# Altium schematic sheet gyro.SchDoc: Fault-Tolerant Quadcopter
size A; DrawnBy: Vaughn Kottler; Engineer: Vaughn Kottler; Revision: A
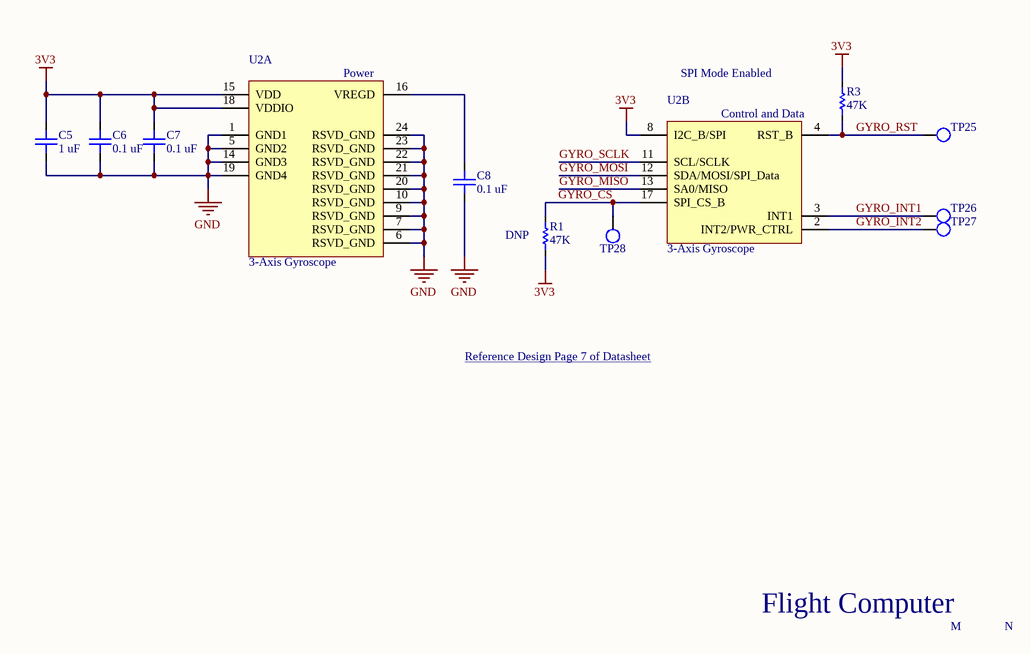
[diagram p0: gyro.SchDoc]

## Parts
C5  1 uF  [CAP-CER-0805-TALL]
C6  0.1 uF  [CAP-CER-0805-SHORT]
C7  0.1 uF  [CAP-CER-0805-SHORT]
C8  0.1 uF  [CAP-CER-0805-SHORT]
R1  47K  [RES-0805]
R3  47K  [RES-0805]
TP25  Test Point  [0603 Test Point]  (value not drawn)
TP26  Test Point  [0603 Test Point]  (value not drawn)
TP27  Test Point  [0603 Test Point]  (value not drawn)
TP28  Test Point  [0603 Test Point]  (value not drawn)
U2  3-Axis Gyroscope  [QFN24]  (parts A,B of 2)

## Nets
3V3: C5.2 C6.2 C7.2 R1.1 R3.2 U2.8(I2C_B/SPI) U2.15(VDD) U2.18(VDDIO)
GND: C5.1 C6.1 C7.1 C8.1 U2.1(GND1) U2.5(GND2) U2.6(RSVD_GND) U2.7(RSVD_GND) U2.9(RSVD_GND) U2.10(RSVD_GND) U2.14(GND3) U2.19(GND4) U2.20(RSVD_GND) U2.21(RSVD_GND) U2.22(RSVD_GND) U2.23(RSVD_GND) U2.24(RSVD_GND)
GYRO_CS: R1.2 TP28.1 U2.17(SPI_CS_B)
GYRO_INT1: TP26.1 U2.3(INT1)
GYRO_INT2: TP27.1 U2.2(INT2/PWR_CTRL)
GYRO_MISO: U2.13(SA0/MISO)
GYRO_MOSI: U2.12(SDA/MOSI/SPI_Data)
GYRO_RST: R3.1 TP25.1 U2.4(RST_B)
GYRO_SCLK: U2.11(SCL/SCLK)
NetC8_2: C8.2 U2.16(VREGD)

## Notes on the sheet
- SPI Mode Enabled
- (near R1) DNP
- Reference Design Page 7 of Datasheet <http://cache.freescale.com/files/sensors/doc/data_sheet/FXAS21002.pdf>
- Flight Computer
- M
- N
- (in symbol FXAS21002C, part A) Power
- (in symbol FXAS21002C, part B) Control and Data

## Library data of the parts
C5 = CAP-CER-1uF-10V: 10%, 0805; ComponentLink1Description: Capacitor Book (Amazon); ComponentLink1URL: https://www.amazon.com/gp/product/B0728HBDRW/
C6-C8 = CAP-CER-0.1uF-25V: 10%, 0805; ComponentLink1Description: Capacitor Book (Amazon); ComponentLink1URL: https://www.amazon.com/gp/product/B0728HBDRW/
R1 R3 = RES-47K-1/8W: 0805; ComponentLink1Description: Resistor Book (Amazon); ComponentLink1URL: https://www.amazon.com/gp/product/B071J21FYF/
TP25-TP28 = Test Point: 0603; Supplier 1: Digi-Key; Supplier Part Number 1: A106145DKR-ND
U2 = FXAS21002C: 3-Axis Digital Angular Rate Gyroscope; Supplier 1: Digi-Key; Supplier Part Number 1: FXAS21002CQR1CT-ND; ComponentLink1Description: Datasheet; ComponentLink1URL: http://cache.freescale.com/files/sensors/doc/data_sheet/FXAS21002.pdf